# EAGLE design hw (EAGLE 5.12)
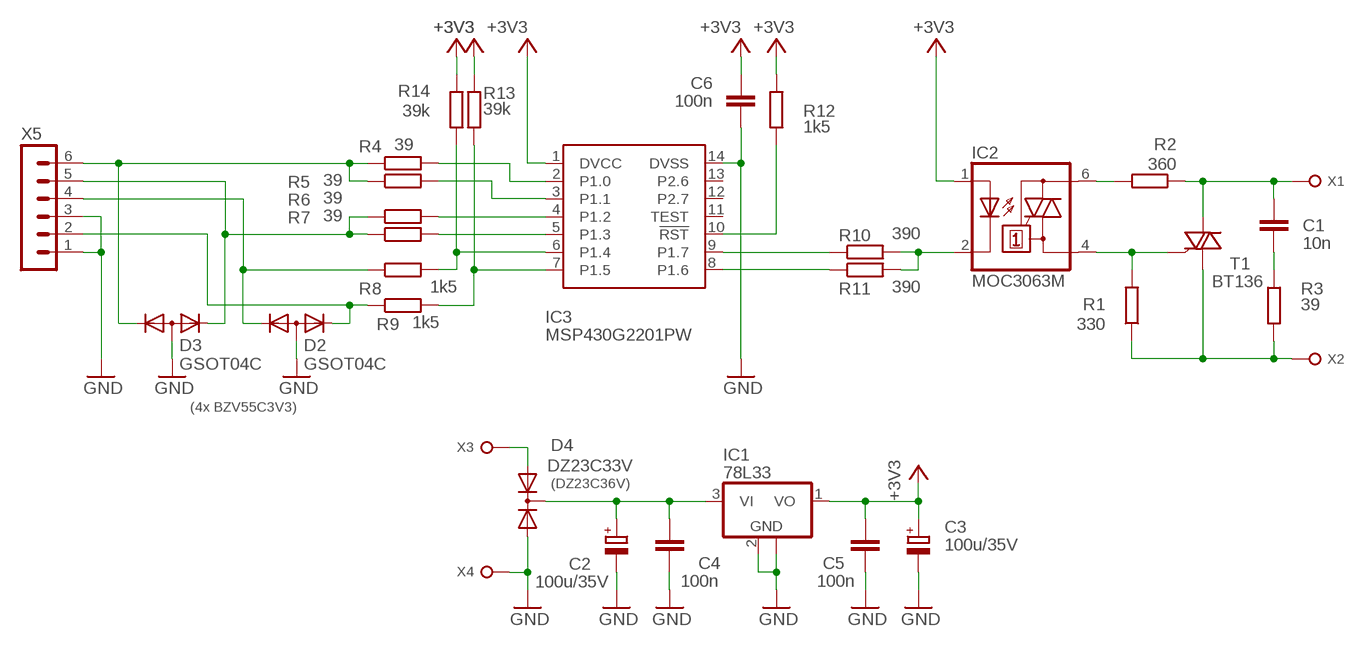
[diagram p0: schematic, sheet 1]

## Parts
C1  10n  C-EU050-025X075  [C050-025X075]
C2  100u/35V  CPOL-EUE2.5-7  [E2,5-7]
C3  100u/35V  CPOL-EUE2.5-7  [E2,5-7]
C4  100n  C-EUC0805  [C0805]
C5  100n  C-EUC0805  [C0805]
C6  100n  C-EUC0805  [C0805]
D2  GSOT04C  DIODE-2CA|ACSOT23  [SOT23]
D3  GSOT04C  DIODE-2CA|ACSOT23  [SOT23]
D4  DZ23C33V  DIODE-2AC|CASOT23  [SOT23]
IC1  78L33  78L15F  [SOT89]
IC2  MOC3063M  MOC3031M  [DIL06]
IC3  MSP430G2201PW  [DIL14]
R1  330  R-EU_MELF0207W  [MINI_MELF-0207W]
R2  360  R-EU_MELF0207W  [MINI_MELF-0207W]
R3  39  R-EU_MELF0207W  [MINI_MELF-0207W]
R4  39  R-EU_R0805  [R0805]
R5  39  R-EU_R0805  [R0805]
R6  39  R-EU_R0805  [R0805]
R7  39  R-EU_R0805  [R0805]
R8  1k5  R-EU_R0805  [R0805]
R9  1k5  R-EU_R0805  [R0805]
R10  390  R-EU_R0805  [R0805]
R11  390  R-EU_R0805  [R0805]
R12  1k5  R-EU_R0805  [R0805]
R13  39k  R-EU_R0805  [R0805]
R14  39k  R-EU_R0805  [R0805]
T1  BT136  [TO220AB]
X1  FASTON2.8L  [F2.8_DPSL]
X2  FASTON2.8L  [F2.8_DPSL]
X3  FASTON2.8L  [F2.8_DPSL]
X4  FASTON2.8L  [F2.8_DPSL]
X5  MA06-1  [MA06-1]

## Nets
+3V3: C3.+ C5.1 C6.1 IC1.1(VO) IC2.1(A) IC3.1(DVCC) R12.2 R13.2 R14.2
GND: C2.- C3.- C4.2 C5.2 C6.2 D2.3(A) D3.3(A) D4.2(A2) IC1.2(GND) IC1.2@1(GND) IC3.14(DVSS) X4.P$1(J) X5.1 X5.3
N$1: IC2.4(A1) R1.2 T1.3(G)
N$2: IC2.6(A2) R2.2
N$3: C1.1 R2.1 T1.2(A2) X1.P$1(J)
N$4: R1.1 R3.2 T1.1(A1) X2.P$1(J)
N$5: C1.2 R3.1
N$6: C2.+ C4.1 D4.3(C) IC1.3(VI)
N$7: D3.2(K2) R6.1 R7.1 X5.5
N$8: D4.1(A1) X3.P$1(J)
N$9: IC3.9(P1.7) R10.1
N$10: IC3.8(P1.6) R11.1
N$11: IC2.2(C) R10.2 R11.2
N$12: D3.1(K1) R4.1 R5.1 X5.6
N$14: IC3.10(!RST) R12.1
N$15: D2.2(K2) R9.1 X5.2
N$16: IC3.4(P1.2) R6.2
N$17: IC3.5(P1.3) R7.2
N$18: IC3.3(P1.1) R5.2
N$19: IC3.2(P1.0) R4.2
N$20: IC3.6(P1.4) R8.2 R14.1
N$21: IC3.7(P1.5) R9.2 R13.1
N$22: D2.1(K1) R8.1 X5.4
Unconnected: IC3.11(TEST) IC3.12(P2.7) IC3.13(P2.6)

## Notes on the sheet
- (4x BZV55C3V3)
- (DZ23C36V)

## Library data of the parts
C1 C4-C6 = rcl:C-EU: CAPACITOR, European symbol
C2 C3 = rcl:CPOL-EU: POLARIZED CAPACITOR, European symbol
D2 D3 = diode:DIODE-2CA|AC: Dual DIODE Cathode-Anode|Anode-Cathode
D4 = diode:DIODE-2AC|CA: Dual DIODE Anode-Cathode|Cathode-Anode
IC1 = linear:78L*: POSITOIV-VOLTAGE REGULATORS Output up to 100 mA Source: http://focus.ti.com/lit/ds/symlink/ua78l05.pdf
IC2 = optocoupler:MOC30*: 6-Pin DIP Zero-Cross Optoisolators Triac Driver Output (250/400 Volt Peak) Source: http://www.fairchildsemi.com/ds/MO/MOC3043-M.pdf; MF: FAIRCHILD SEMICONDUCTOR; MPN: MOC3031M; OC_FARNELL: 9875964; OC_NEWARK: 78K6089
IC3 = texas:MSP430G2201
R1-R14 = rcl:R-EU_: RESISTOR, European symbol
T1 = triac:BT136: Triac BT136 series E sensitive gate Source: http://www.nxp.com/acrobat_download/datasheets/BT136_SERIES_E_2.pdf
X1-X4 = conector:FASTON2.8
X5 = con-lstb:MA06-1: PIN HEADER; OC_FARNELL: unknown; OC_NEWARK: unknown

## Board
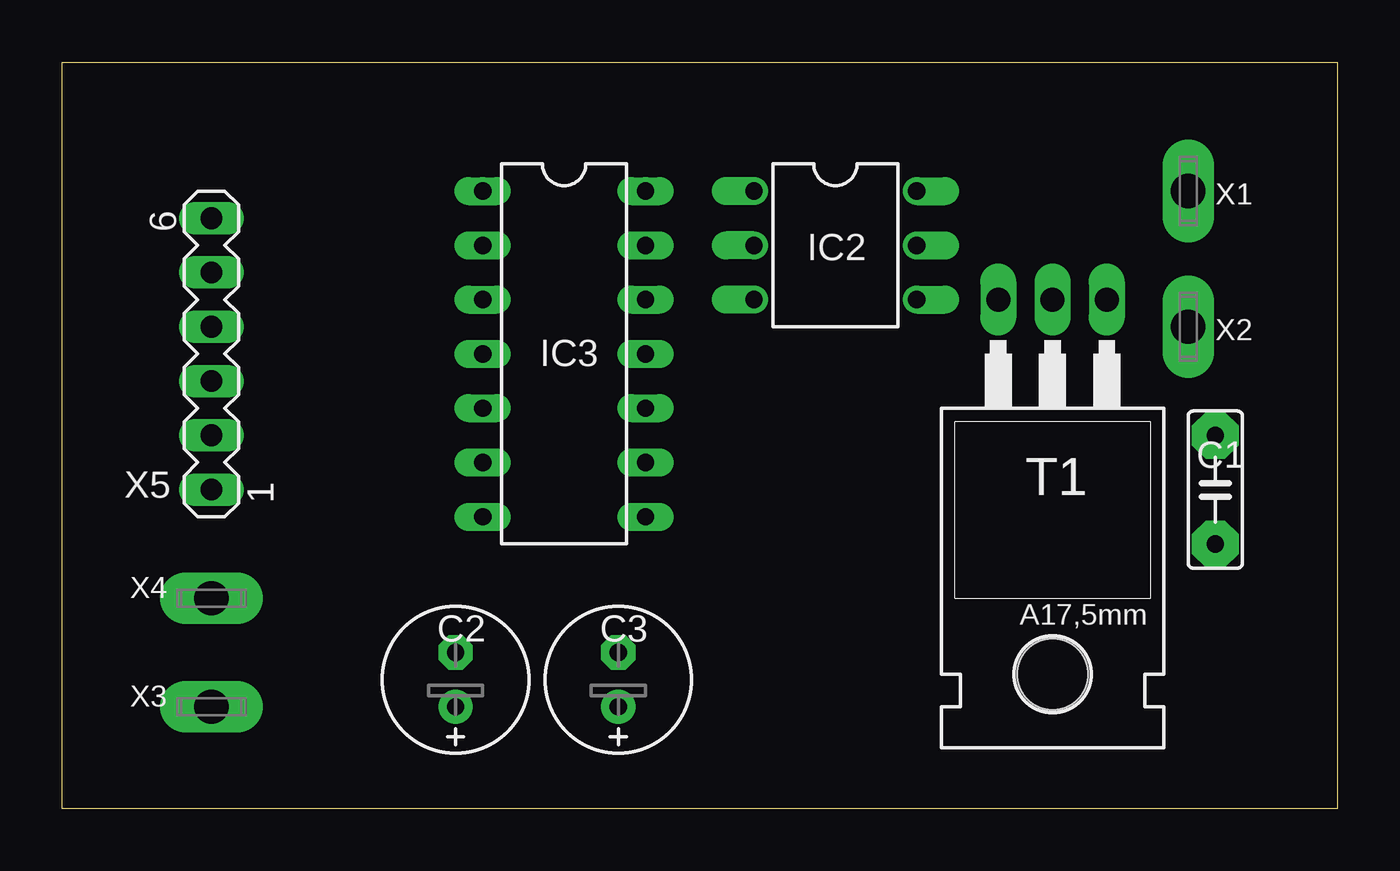
[diagram p1: board, top side]
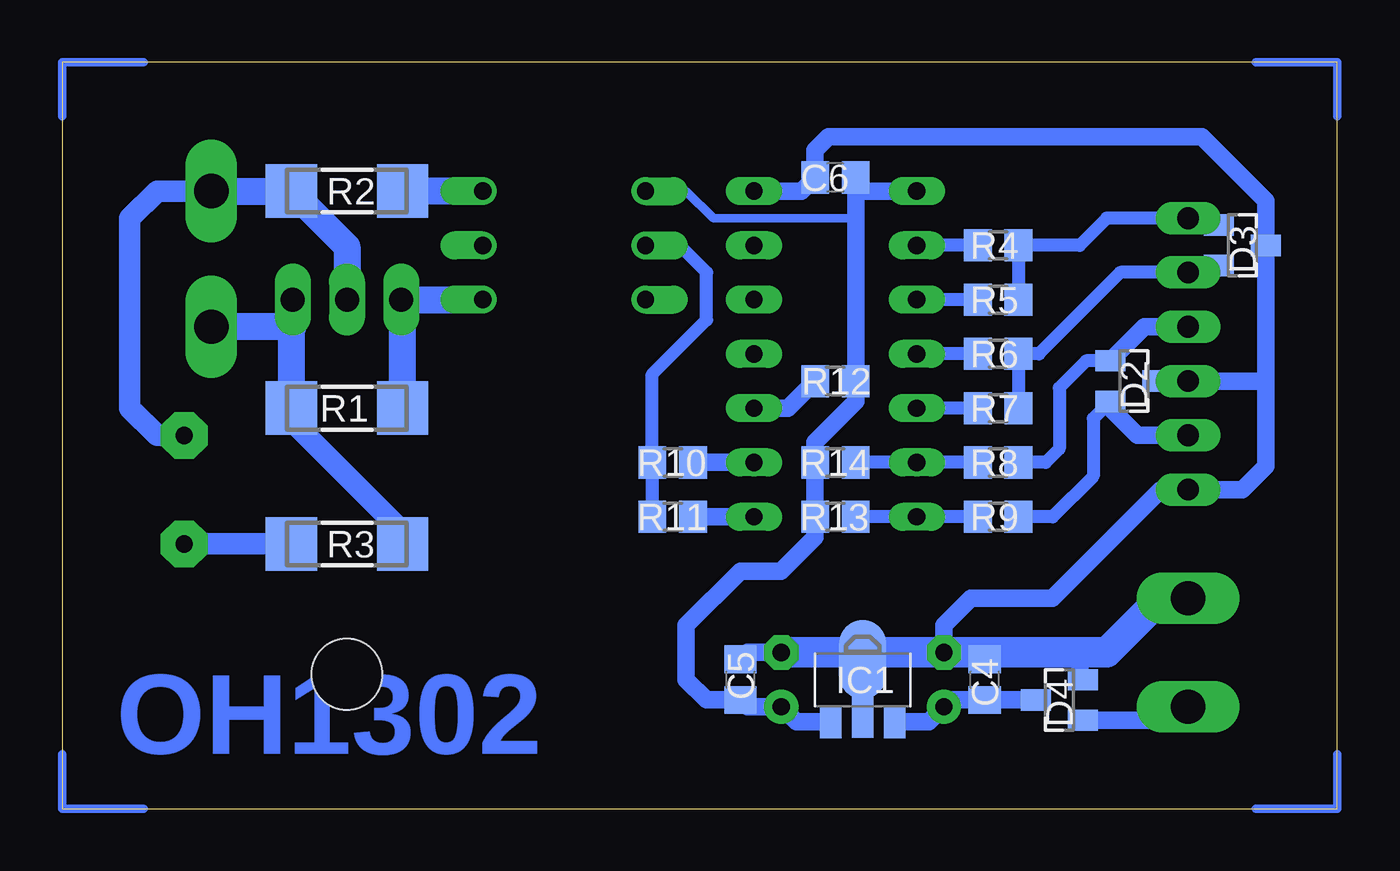
[diagram p2: board, bottom side, seen from below]

Size 59.69 x 34.92 mm. Coordinates in mm from the lower left corner, seen from the top.
Outline: 0,0 0,34.92 59.69,34.92 59.69,0 0,0
Copper layers (1*16): Top 0.035mm / dielectric 1.5mm / Bottom 0.035mm
Design rules "default": minimum track width 10mil, minimum drill 24mil, track to track 8mil, track to pad 8mil, pad to pad 8mil, via to via 8mil, smd to smd 8mil, copper to edge 40mil, drill to drill 8mil, minimum pad ring 10mil, minimum via ring 8mil, stop-mask expansion 4mil, vias tented up to drill 0mil, thermal gap 10mil

### Footprints (pad centres in the part's own frame; a part is rotated, then mirrored left to right if it is on the bottom)
C050-025X075 = drill 0.813 octagon: 1 -2.54,0; 2 2.54,0
E2,5-7 = drill 0.813 pad 1.6 round: + -1.27,0 | drill 0.813 pad 1.6 octagon: - 1.27,0
C0805 = smd 1.3 x 1.5: 1 -0.95,0; 2 0.95,0
SOT23 = smd 1 x 1.4: 1 -0.95,-1.1; 2 0.95,-1.1; 3 0,1.1
SOT89 = smd 1 x 1.5: 1 -1.499,-1.981; 3 1.499,-1.981 | smd 1 x 2: 2 0,-1.727 | smd 2.2 x 3.7: 2@1 0,0.94
DIL06 = drill 0.813 offset: 1 -2.54,-3.81; 2 0,-3.81; 3 2.54,-3.81; 4 2.54,3.81; 5 0,3.81; 6 -2.54,3.81
DIL14 = drill 0.813 long: 1 -7.62,-3.81; 2 -5.08,-3.81; 3 -2.54,-3.81; 4 0,-3.81; 5 2.54,-3.81; 6 5.08,-3.81; 7 7.62,-3.81; 8 7.62,3.81; 9 5.08,3.81; 10 2.54,3.81; 11 0,3.81; 12 -2.54,3.81; 13 -5.08,3.81; 14 -7.62,3.81
MINI_MELF-0207W = smd 2.4 x 2.5: 1 -2.6,0; 2 2.6,0
R0805 = smd 1.3 x 1.5: 1 -0.95,0; 2 0.95,0
TO220AB = drill 1.118 long: 1 -2.54,-6.35; 2 0,-6.35; 3 2.54,-6.35 | hole 3.302: 0,11.176
F2.8_DPSL = drill 1.6 long: P$1 0,0
MA06-1 = drill 1.016 long: 1 -6.35,0; 2 -3.81,0; 3 -1.27,0; 4 1.27,0; 5 3.81,0; 6 6.35,0

### Placement (x,y rotation side)
C1  53.98,14.92 270 top
C2  18.41,6.03 90 top
C3  26.04,6.03 90 top
C4  16.51,6.03 90 bottom
C5  27.94,6.03 90 bottom
C6  23.5,29.53 180 bottom
D2  9.53,20 270 bottom
D3  4.45,26.35 270 bottom
D4  13.02,5.08 90 bottom
IC1  22.23,6.03 0 bottom
IC2  36.2,26.35 270 top
IC3  23.5,21.27 270 top
R1  46.35,18.73 0 bottom
R2  46.35,28.89 0 bottom
R3  46.35,12.38 0 bottom
R4  15.88,26.35 180 bottom
R5  15.88,23.81 180 bottom
R6  15.88,21.27 180 bottom
R7  15.88,18.73 180 bottom
R8  15.88,16.19 180 bottom
R9  15.88,13.65 180 bottom
R10  31.11,16.19 180 bottom
R11  31.11,13.65 180 bottom
R12  23.5,20 0 bottom
R13  23.5,13.65 180 bottom
R14  23.5,16.19 180 bottom
T1  46.35,17.46 180 top
X1  52.7,28.89 270 top
X2  52.7,22.54 270 top
X3  6.99,4.76 0 top
X4  6.99,9.84 0 top
X5  6.99,21.27 90 top

### Tracks (layer width: path | path; a pad name or v marks a point on that pad's centre or on a via)
+3V3
  Bottom 0.406: IC2.1 30.48,28.89 29.21,27.62 22.55,27.62
  Bottom 0.813: IC3.1 22.54,28.89 C6.1 22.55,27.62 R12.2 22.55,19.05 24.45,17.15 R14.2 R13.2 24.45,12.7 26.04,11.11 27.94,11.11 30.48,8.57 30.48,6.03 29.53,5.08 C5.1 27.62,4.76 C3.+ 25.32,4.05 IC1.1
GND
  Bottom 0.813: IC3.14 25.08,28.89 C6.2 24.45,30.8 23.81,31.43 6.35,31.43 3.35,28.43 D3.3 3.35,20 | D2.3 X5.3 3.35,20 | 3.35,20 3.35,16.02 4.45,14.92 X5.1 8.26,14.92 13.34,9.84 17.14,9.84 18.41,8.57 C2.- | C5.2 27.62,7.3 C3.- | IC1.2@1 IC1.2 | D4.2 12.06,6.18 12.06,7.3
  Bottom 1.016: 15.88,7.3 C4.2
  Bottom 1.422: X4.P$1 8.26,9.84 10.79,7.3 12.06,7.3 15.88,7.3 C2.- 22.23,7.3 | 22.23,7.3 C3.- | 22.23,7.3 IC1.2@1
N$1
  Bottom 1.27: R1.2 43.76,23.75 T1.3 IC2.4
N$2
  Bottom 1.27: IC2.6 R2.2
N$3
  Bottom 1.016: C1.1 55.24,17.46 56.52,18.73 56.52,27.62 55.24,28.89 X1.P$1
  Bottom 1.27: T1.2 46.35,26.29 R2.1 X1.P$1
N$4
  Bottom 1.016: R1.1 48.9,18.67 48.9,18.1 43.81,13.02 43.81,12.38 R3.2
  Bottom 1.27: R1.1 48.95,23.75 T1.1 48.9,22.54 X2.P$1
N$5
  Bottom 1.016: R3.1 C1.2
N$6
  Bottom 0.813: IC1.3 19.13,4.05 C2.+ 18.09,5.08 C4.1 D4.3
N$7
  Bottom 0.61: R7.1 R6.1 13.97,21.27 10.16,25.08 X5.5
  Bottom 0.813: D3.2 5.87,25.08 X5.5
N$8
  Bottom 0.813: D4.1 7.62,4.13 X3.P$1
N$9
  Bottom 0.813: IC3.9 R10.1
N$10
  Bottom 0.813: IC3.8 R11.1
N$11
  Bottom 0.61: IC2.2 30.8,26.35 29.53,25.08 29.53,22.86 32.07,20.32 32.07,16.83 R10.2 R11.2
N$12
  Bottom 0.61: R5.1 R4.1 12.06,26.35 10.79,27.62 X5.6
  Bottom 0.813: D3.1 5.87,27.62 X5.6
N$13
  Bottom 0.406: 3.81,0 0,0 0,2.54
N$14
  Bottom 0.813: R12.1 25.71,18.73 IC3.10
N$15
  Bottom 0.61: R9.1 13.34,13.65 11.43,15.56 11.43,18.25 D2.2
  Bottom 0.813: D2.2 10.79,18.88 9.38,17.46 X5.2
N$16
  Bottom 0.61: R6.2 IC3.4
N$17
  Bottom 0.61: R7.2 IC3.5
N$18
  Bottom 0.61: R5.2 IC3.3
N$19
  Bottom 0.61: R4.2 IC3.2
N$20
  Bottom 0.61: R14.1 IC3.6 R8.2
N$21
  Bottom 0.61: R13.1 IC3.7 R9.2
N$22
  Bottom 0.61: D2.1 11.75,20.95 13.02,19.68 13.02,16.83 13.65,16.19 R8.1
  Bottom 0.813: D2.1 9.04,22.54 X5.4
N$23
  Bottom 0.406: 55.88,0 59.69,0 59.69,2.54
N$24
  Bottom 0.406: 59.69,32.38 59.69,34.92 55.88,34.92
N$25
  Bottom 0.406: 3.81,34.92 0,34.92 0,32.38
N$26  (via drill 0.5 pad 1.27)
  other vias: 6.99,27.62
N$27  (via drill 0.5 pad 1.27)
  other vias: 6.99,25.08
N$28  (via drill 0.5 pad 1.27)
  other vias: 6.99,22.54
N$29  (via drill 0.5 pad 1.27)
  other vias: 6.99,20
N$30  (via drill 0.5 pad 1.27)
  other vias: 6.99,17.46
N$31  (via drill 0.5 pad 1.27)
  other vias: 6.99,14.92
N$32  (via drill 0.5 pad 1.27)
  other vias: 19.68,28.89
N$33  (via drill 0.5 pad 1.27)
  other vias: 19.68,26.35
N$34  (via drill 0.5 pad 1.27)
  other vias: 19.68,23.81
N$35  (via drill 0.5 pad 1.27)
  other vias: 19.68,21.27
N$36  (via drill 0.5 pad 1.27)
  other vias: 19.68,18.73
N$37  (via drill 0.5 pad 1.27)
  other vias: 19.68,16.19
N$38  (via drill 0.5 pad 1.27)
  other vias: 19.68,13.65
N$39  (via drill 0.5 pad 1.27)
  other vias: 27.3,28.89
N$40  (via drill 0.5 pad 1.27)
  other vias: 27.3,26.35
N$41  (via drill 0.5 pad 1.27)
  other vias: 27.3,23.81
N$42  (via drill 0.5 pad 1.27)
  other vias: 27.3,21.27
N$43  (via drill 0.5 pad 1.27)
  other vias: 27.3,18.73
N$44  (via drill 0.5 pad 1.27)
  other vias: 27.3,16.19
N$45  (via drill 0.5 pad 1.27)
  other vias: 27.3,13.65
N$46  (via drill 0.5 pad 1.27)
  other vias: 32.38,28.89
N$47  (via drill 0.5 pad 1.27)
  other vias: 32.38,26.35
N$48  (via drill 0.5 pad 1.27)
  other vias: 32.38,23.81
N$49  (via drill 0.5 pad 1.27)
  other vias: 40.01,28.89
N$50  (via drill 0.5 pad 1.27)
  other vias: 40.01,26.35
N$51  (via drill 0.5 pad 1.27)
  other vias: 40.01,23.81
N$52  (via drill 0.5 pad 1.27)
  other vias: 43.81,23.81
N$53  (via drill 0.5 pad 1.27)
  other vias: 46.35,23.81
N$54  (via drill 0.5 pad 1.27)
  other vias: 48.9,23.81
N$55  (via drill 0.5 pad 2.18)
  other vias: 53.98,17.46
N$56  (via drill 0.5 pad 2.18)
  other vias: 53.98,12.38
N$57  (via drill 0.5 pad 1.27)
  other vias: 18.41,7.3
N$58  (via drill 0.5 pad 1.27)
  other vias: 18.41,4.76
N$59  (via drill 0.5 pad 1.27)
  other vias: 26.04,7.3
N$60  (via drill 0.5 pad 1.27)
  other vias: 26.04,4.76
N$61  (via drill 0.5 pad 2.18)
  other vias: 6.99,9.84
N$62  (via drill 0.5 pad 2.18)
  other vias: 6.99,4.76
N$63  (via drill 0.5 pad 2.18)
  other vias: 52.7,22.54
N$64  (via drill 0.5 pad 2.18)
  other vias: 52.7,28.89

### Text on the board
Bottom: OH1302
Measures: 60 | 35